# EAGLE schematic MSSRP-Connectors (EAGLE 6.6.0)
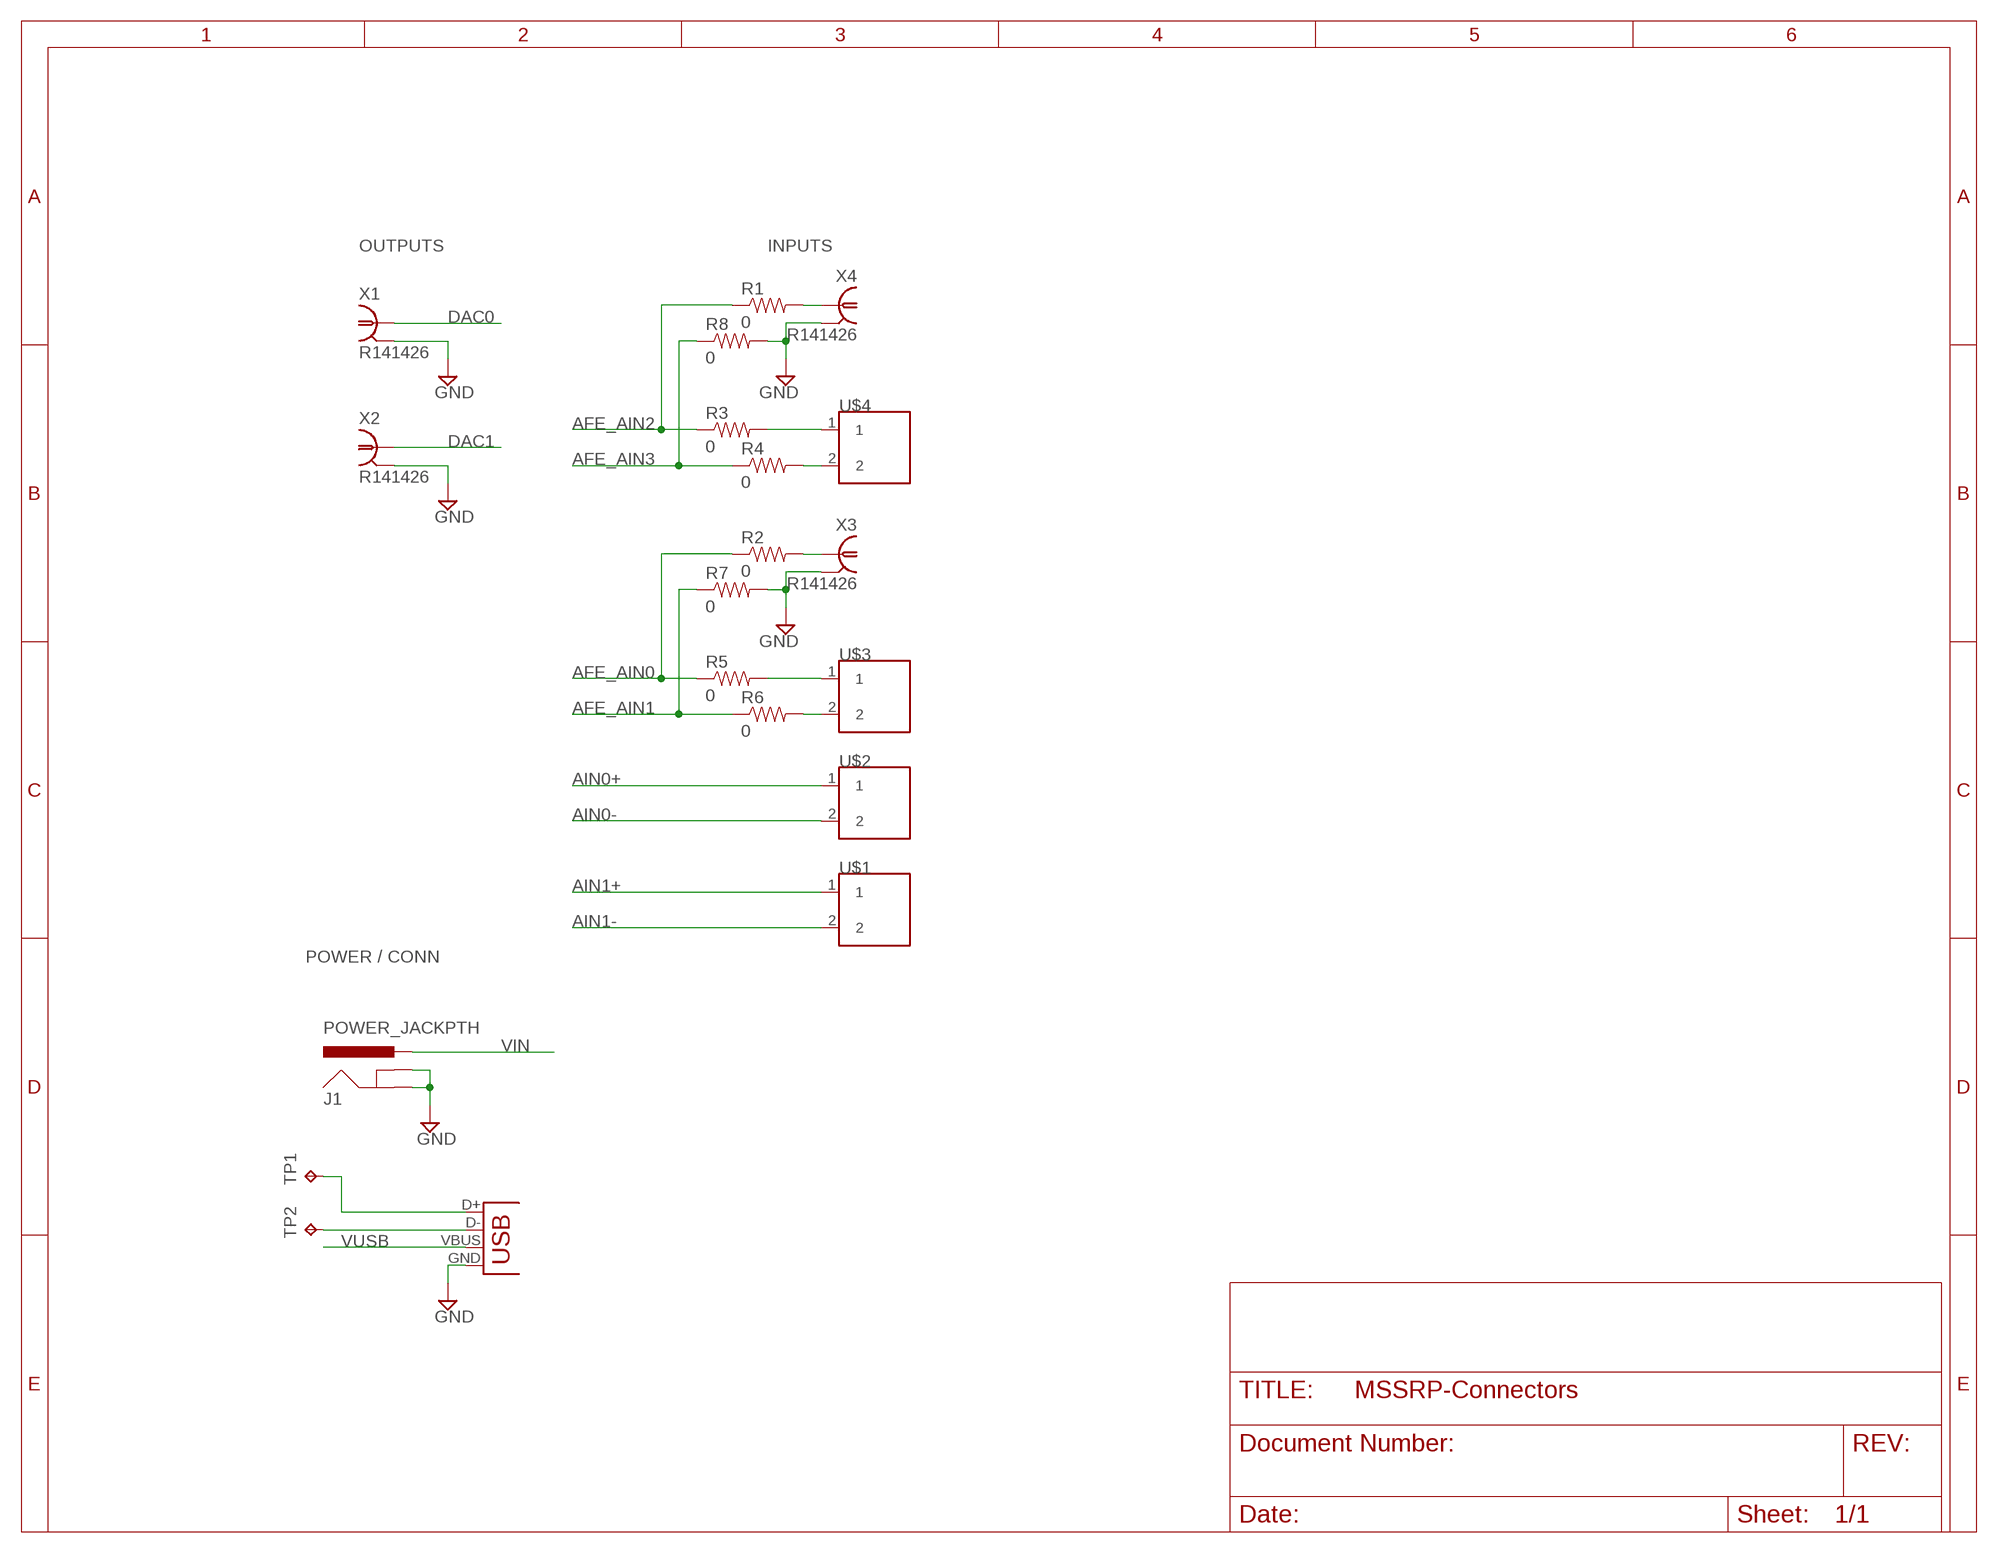
[diagram p0: schematic, sheet 1]

## Parts
J1  POWER_JACKPTH  [POWER_JACK_PTH]
JP1  USBSMD  [USB-MINIB]
R1  0  0OHM1/10W5%(0603)  [0603]
R2  0  0OHM1/10W5%(0603)  [0603]
R3  0  0OHM1/10W5%(0603)  [0603]
R4  0  0OHM1/10W5%(0603)  [0603]
R5  0  0OHM1/10W5%(0603)  [0603]
R6  0  0OHM1/10W5%(0603)  [0603]
R7  0  0OHM1/10W5%(0603)  [0603]
R8  0  0OHM1/10W5%(0603)  [0603]
TP1  TPPAD1-13  [P1-13]
TP2  TPPAD1-13  [P1-13]
U$1  TE-2-TERMBLOCK  [TE-2-TERMBLOCK]
U$2  TE-2-TERMBLOCK  [TE-2-TERMBLOCK]
U$3  TE-2-TERMBLOCK  [TE-2-TERMBLOCK]
U$4  TE-2-TERMBLOCK  [TE-2-TERMBLOCK]
X1  R141426  [R141426]
X2  R141426  [R141426]
X3  R141426  [R141426]
X4  R141426  [R141426]

## Nets
AFE_AIN0: R2.1 R5.1
AFE_AIN1: R6.1 R7.1
AFE_AIN2: R1.1 R3.1
AFE_AIN3: R4.1 R8.1
AIN0+: U$2.1
AIN0-: U$2.2
AIN1+: U$1.1
AIN1-: U$1.2
DAC0: X1.1
DAC1: X2.1
GND: J1.GND J1.GNDBREAK JP1.GND R7.2 R8.2 X1.2 X1.3 X1.4 X1.5 X2.2 X2.3 X2.4 X2.5 X3.2 X3.3 X3.4 X3.5 X4.2 X4.3 X4.4 X4.5
N$1: JP1.D- TP2.TP
N$2: R2.2 X3.1
N$3: JP1.D+ TP1.TP
N$4: R1.2 X4.1
N$5: R3.2 U$4.1
N$6: R4.2 U$4.2
N$7: R5.2 U$3.1
N$8: R6.2 U$3.2
VIN: J1.PWR
VUSB: JP1.VBUS

## Notes on the sheet
- OUTPUTS | INPUTS
- POWER / CONN

## Library data of the parts
J1 = SparkFun-Connectors:POWER_JACK: Power Jack This is the standard 5.5mm barrel jack for power. The PTH is the most common, proven, reliable, footprint. The Slot footprint only works if the mill layer is transmitted to the PCB fab house so be warned. Mating wall wart : TOL-00298 (and others); PROD_ID: PRT-00119
JP1 = SparkFun-Connectors:USB: USB Connectors USB-B-PTH is fully proven SKU : PRT-00139/CONN-08278 USB-miniB is fully proven SKU : PRT-00587 USB-A-PCB is untested. USB-A-H is throughly reviewed, but untested. Spark Fun Electronics SKU : PRT-00437 USB-B-SMT is throughly reviewed, but untested. Needs silkscreen touching up. USB-A-S has not been used/tested USB-MB-H has not been used/tested USB-MICROB has been used. CONN-09505; PROD_ID: CONN-08193
R1-R8 = SparkFun-Resistors:0OHM1/10W5%(0603): RES-08609; PROD_ID: RES-08609
TP1 TP2 = testpad:TP: Test pad
U$1-U$4 = MSSRP-Lib:TE-2-TERMBLOCK
X1-X4 = con-coax:R141426: BNC COAX CONNECTOR Radiall 50/75 Ohm Spoerle; MF: FARNELL; MPN: R141426161; OC_FARNELL: 4195115; OC_NEWARK: 14J7919